# EAGLE design BIRDS-5_FM_+Y Panel_Ver2 (EAGLE 9.6.2)
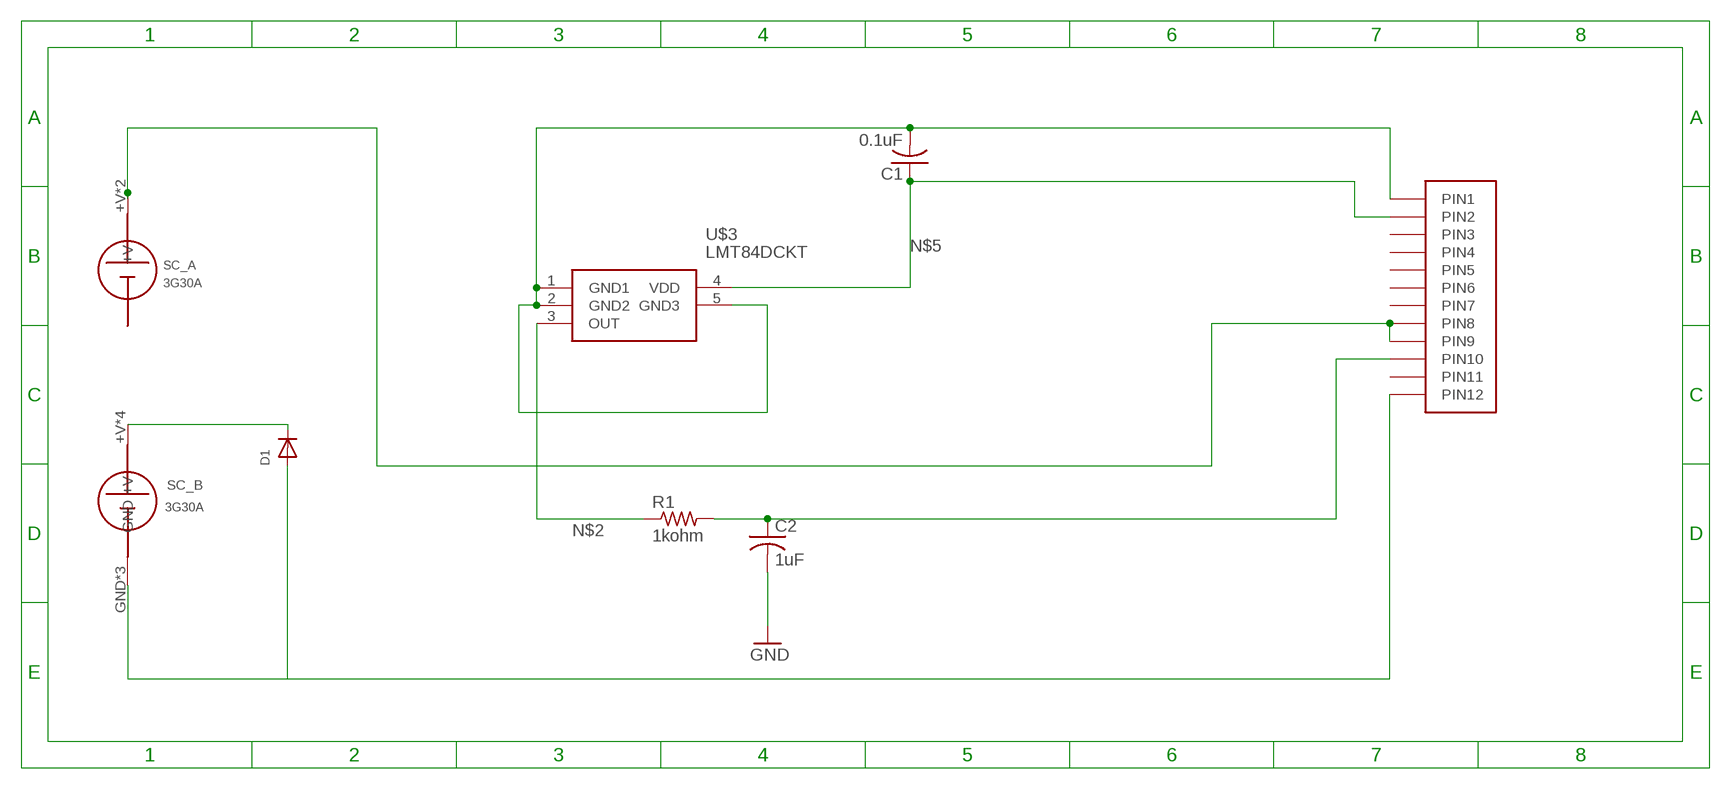
[diagram p0: schematic, sheet 1]

## Parts
C1  0.1uF  C-USC0805  [C0805]
C2  1uF  C-USC0805  [C0805]
D1  DIODE_SOD-123FL  [SOD-123FL]
R1  1kohm  R-US_R0402  [R0402]
SOLARCELL_A  SC_A  [SC_A]
U$1  HEADER12PIN  [HEADER12PIN]
U$2  SC_B-2_SC_B  [SC_B-2_SC_B]
U$3  LMT84DCKT  [SOT65P210X110-5N]

## Nets
+V: SOLARCELL_A.+V SOLARCELL_A.+V1(+V) U$1.P8(PIN8) U$1.P9(PIN9)
+VB: D1.C U$2.+V U$2.+V2(+V) U$2.+V3(+V) U$2.+V4(+V)
GND: C1.2 C2.2 D1.A U$1.P1(PIN1) U$1.P12(PIN12) U$2.GND U$2.GND1(GND) U$2.GND2(GND) U$3.1(GND1) U$3.2(GND2) U$3.5(GND3)
N$2: R1.1 U$3.3(OUT)
N$5: C1.1 U$1.P2(PIN2) U$3.4(VDD)
N$10: C2.1 R1.2 U$1.P10(PIN10)
Unconnected: U$1.P3(PIN3) U$1.P4(PIN4) U$1.P5(PIN5) U$1.P6(PIN6) U$1.P7(PIN7) U$1.P11(PIN11)

## Library data of the parts
C1 C2 = adafruit:C-US: CAPACITOR, American symbol
D1 = adafruit:DIODE: Diode SMADIODE - SMA Surface Mount Package 20V 1A Schottky Diode Digikey: 641-1014-6-ND DO-1N4148 - Through Hole Small Current Diode SOD-123 20V 1 A (.5mV Vf) Schottky Diode - Digikey: MBRX120TPMSCT-ND SOD-323 10V 570mA (.38mV Vf, 3ns) Schottky Diode - Digikey: ZLLS410CT-ND SOD-523 30V 30mA Schottky Diode (RB751S-40TE61) - Digikey: RB751S-40TE61CT-ND SOT23-R/W - SOT23 Package (R = Solder Paste/Reflow Ovens, W = Hand-Soldering) BAT54Film 40V 300mA - Digikey: 497-7162-1-ND
R1 = adafruit:R-US_: RESISTOR, American symbol
SOLARCELL_A = SC_A:SC_A
U$1 = BIRDS:HEADER12PIN
U$2 = B5_EM_-Y_Panel:SC_B-2_SC_B
U$3 = LMT84DCKT:LMT84DCKT: 1.5V-Capable, 10 uA Analog Output Temperature Sensor in SC70 and TO-92 Source: Datasheet <http://uk.rs-online.com/web/p/products/8115860>; DESCRIPTION: 1.5V-Capable, 10 uA Analog Output Temperature Sensor in SC70 and TO-92; HEIGHT: 1.1mm; MANUFACTURER_NAME: Texas Instruments; MANUFACTURER_PART_NUMBER: LMT84DCKT; RS_PART_NUMBER: 8115860

## Board
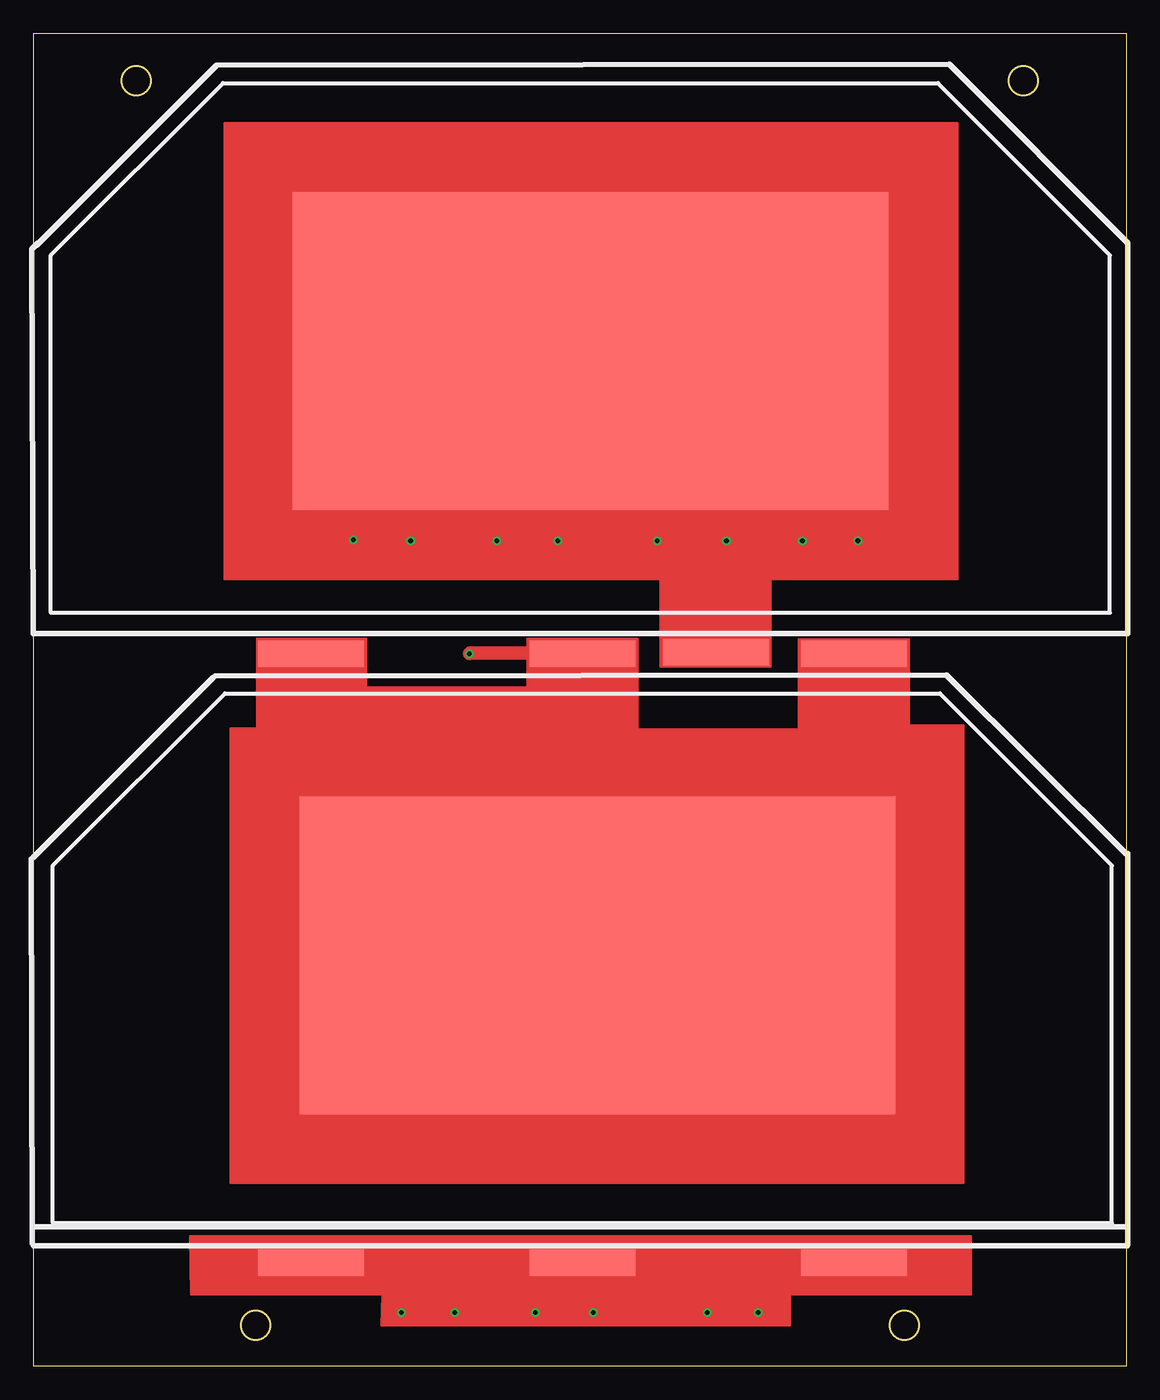
[diagram p1: board, top side]
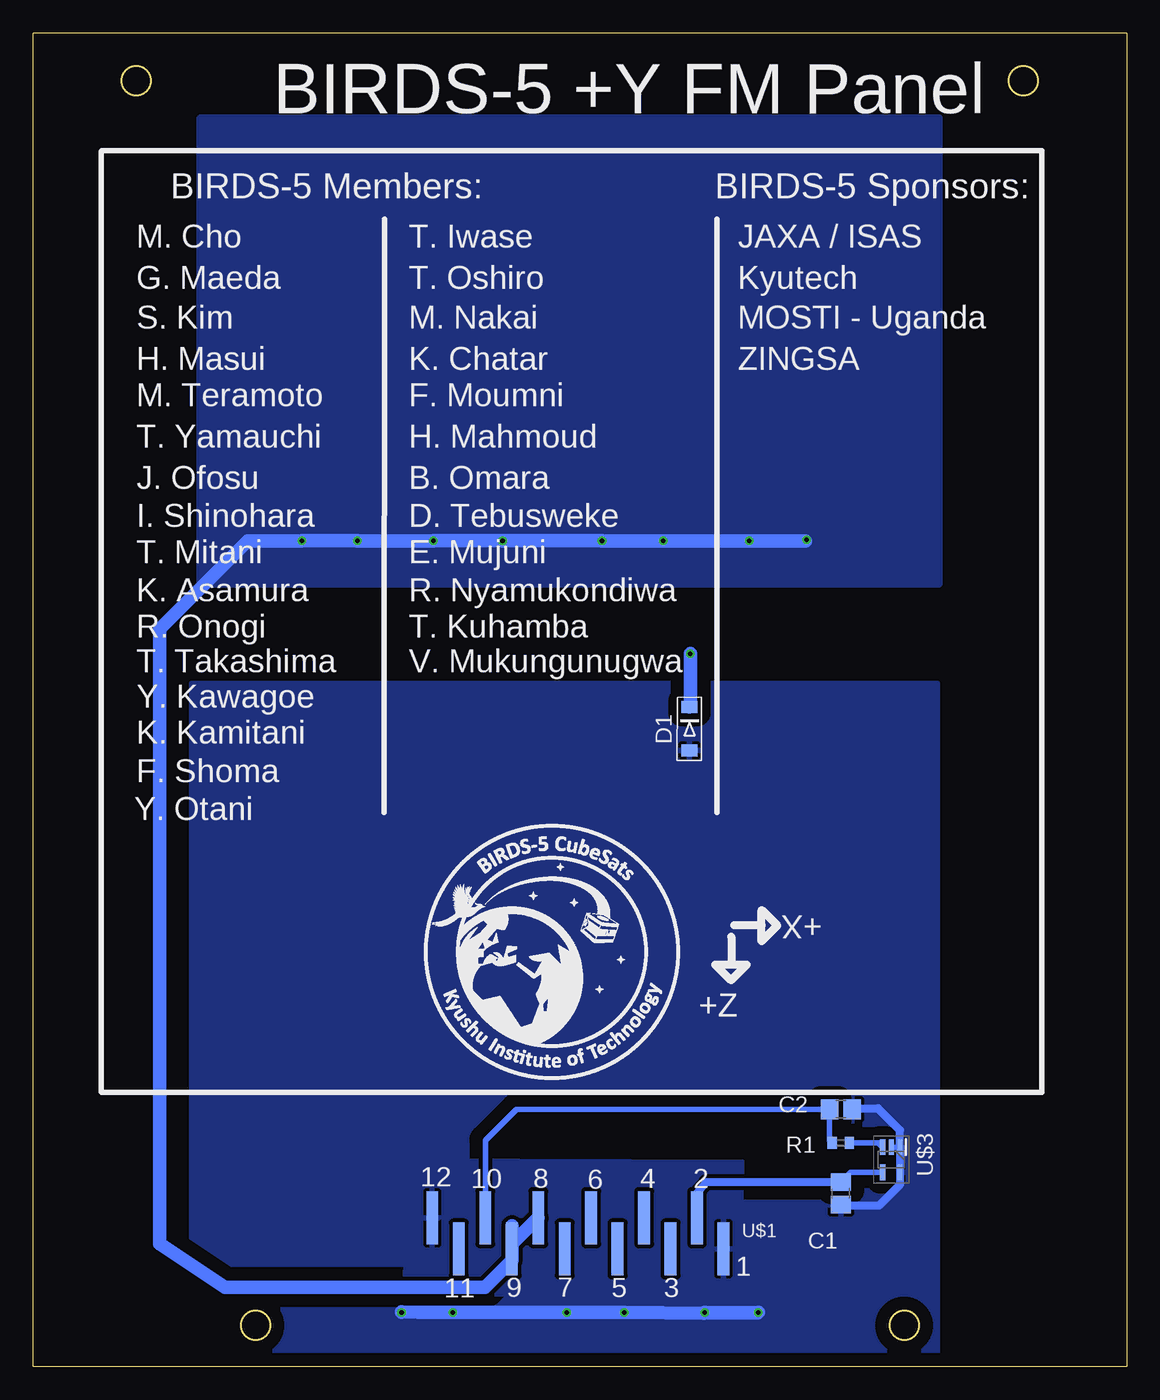
[diagram p2: board, bottom side, seen from below]

Size 82.6 x 100.7 mm. Coordinates in mm from the lower left corner, seen from the top.
Outline: 82.6,0 82.6,100.7 0,100.7 0,0 82.6,0
Outline: circle at 74.8,97.1 radius 1.1
Outline: circle at 65.8,3.1 radius 1.1
Outline: circle at 16.8,3.1 radius 1.1
Outline: circle at 7.8,97.09 radius 1.1
Copper layers (1*16): Top 0.035mm / dielectric 1.53mm / Bottom 0.035mm
Design rules "pban_5mil-l2 *": minimum track width 5mil, minimum drill 0.3mm, track to track 5mil, track to pad 0.229mm, pad to pad 5mil, via to via 5mil, smd to smd 5mil, copper to edge 0.5mm, drill to drill 0.5mm, minimum pad ring 0.15mm, minimum via ring 0.15mm, stop-mask expansion 0.05mm, vias tented up to drill 0.35mm, thermal gap 10mil

### Footprints (pad centres in the part's own frame; a part is rotated, then mirrored left to right if it is on the bottom)
C0805 = smd 1.3 x 1.5: 1 -0.85,0; 2 0.85,0
SOD-123FL = smd 0.91 x 1.22 bottom: A 1.637,0; C -1.637,0
R0402 = smd 0.7 x 0.9: 1 -0.65,0; 2 0.65,0
SC_A = smd 45 x 24: +V 40.75,19.75 | smd 8 x 2: +V1 50.25,-3
HEADER12PIN = smd 4 x 0.89: P1 0,0; P2 2.35,2; P3 0,4; P4 2.35,6; P5 0,8; P6 2.35,10; P7 0,12; P8 2.35,14; P9 0,16; P10 2.35,18; P11 0,20; P12 2.35,22
SC_B-2_SC_B = smd 45 x 24: +V 41.14,20.22 | smd 8 x 2: +V2 19.5,43; +V3 40,43; +V4 60.5,43; GND 60.5,-3; GND1 19.5,-3; GND2 40,-3
SOT65P210X110-5N = smd 1.2 x 0.4: 1 -0.95,0.65; 2 -0.95,0; 3 -0.95,-0.65; 4 0.95,-0.65; 5 0.95,0.65

### Placement (x,y rotation side)
C1  21.59,13.07 270 bottom
C2  21.59,19.42 0 bottom
D1  33.02,48.16 270 top
R1  21.59,16.88 180 bottom
SOLARCELL_A  1.34,56.93 0 top
U$1  30.45,8.88 90 bottom
U$2  1.49,10.83 0 top
U$3  17.78,15.61 270 bottom

### Tracks (layer width: path | path; a pad name or v marks a point on that pad's centre or on a via)
+V  (via drill 0.35)
  Top 0.152: 51.81,53.81 SOLARCELL_A.+V1 | 41.83,76.37 39.63,74.17 v39.63,62.35 39.63,73.65 40.75,74.77 40.75,74.9 42.15,76.3 SOLARCELL_A.+V | 41.83,76.37 42.04,76.37 42.04,76.44 41.9,76.44 41.83,76.37 | 51.81,62.09 52.22,62.09 v52.37,62.35 52.44,62.24
  Top 1.016: 51.81,62.09 51.81,53.81
  Bottom 0.152: 46.44,10.61 46.31,10.4 46.31,10.39 46.29,10.35 46.09,10.15 46.09,9.24 U$1.P9 | 24.25,62.35 v24.18,62.42
  Bottom 1.016: 46.44,10.61 46.44,9.24 | 24.25,62.35 v28.51,62.35 v35.01,62.35 v39.63,62.35 39.64,62.36 47.13,62.36 v47.14,62.35 47.17,62.38 52.33,62.38 v52.37,62.35 v52.38,62.34 v58.1,62.34 v58.11,62.35 v58.12,62.36 v62.29,62.36 v62.3,62.35 66.4,62.35 73.05,55.7 73.05,9.27 68.09,5.97 48.46,5.97 46.44,8 46.44,9.24 | U$1.P8 46.44,9.24
  pour Bottom (isolate 1.016): 14.22,94.28 14.22,59.1 69.95,59.1 69.95,94.27 14.23,94.27
+VB  (via drill 0.35)
  Top 0.152: 39.62,53.83 39.58,53.87
  Top 1.016: 39.58,53.87 33,53.87 v32.96,53.83 | U$2.+V2 20.99,50.73 28.36,43.36 28.36,38.15 35.53,38.15 U$2.+V | U$2.+V4 61.99,43.14 54.06,35.21 46.79,35.21 U$2.+V | 39.62,53.83 U$2.+V3 41.49,39.28 38.99,36.78 38.99,34.69 U$2.+V
  Bottom 1.016: v32.96,53.83 32.96,49.86 D1.C
GND  (via drill 0.35)
  Top 0.152: 37.85,4.16 v37.94,4.08 | 27.84,4.1 v27.82,4.08
  Top 1.016: U$2.GND1 24.98,7.83 27.84,4.97 27.84,4.1 | v42.3,4.08 42.3,7.02 U$2.GND2 U$2.GND 55.76,7.83 54.77,6.84 v54.77,4.08
  Bottom 0.406: U$3.1 U$3.2 | 20.67,19.49 C2.2
  Bottom 0.61: 20.67,19.49 18.79,19.49 17.13,17.83 U$3.1 U$3.5 17.13,13.72 18.69,12.16 21.53,12.16 C1.2
  Bottom 1.016: v27.82,4.08 27.86,4.04 31.82,4.04 v31.86,4.08 31.92,4.02 37.92,4.1 v37.94,4.08 v37.95,4.09 v42.3,4.08 | v42.3,4.08 | v50.91,4.08 53.53,4.08 54.75,4.12 v54.77,4.08 | v42.3,4.08 50.81,4.1
  pour Bottom (isolate 0.305): 29.01,15.45 54.29,15.57 54.56,5.39 48.99,5.46 29.18,5.46
  pour Bottom (isolate 1): 14.29,51.56 70.64,51.56 70.64,0.9 14.29,0.9
N$2
  Bottom 0.406: R1.1 20.92,16.9 18.77,16.9 U$3.3
N$5
  Bottom 0.406: U$3.4 20.85,14.66 C1.1
  Bottom 0.61: C1.1 31.75,13.92 32.45,13.08 U$1.P2
N$10
  Bottom 0.152: R1.2 22.44,17.08
  Bottom 0.406: 22.44,17.08 C2.1 46.1,19.42 48.44,17.08 48.44,11.38 U$1.P10

### Text on the board
bPlace: BIRDS-5 +Y FM Panel | BIRDS-5 Sponsors: | BIRDS-5 Members: | JAXA / ISAS | T. Iwase | M. Cho | Kyutech | T. Oshiro | G. Maeda | MOSTI - Uganda | M. Nakai | S. Kim | ZINGSA | K. Chatar | H. Masui | F. Moumni | M. Teramoto | H. Mahmoud | T. Yamauchi | B. Omara | J. Ofosu | D. Tebusweke | I. Shinohara | E. Mujuni | T. Mitani | R. Nyamukondiwa | K. Asamura | T. Kuhamba | R. Onogi | V. Mukungunugwa | T. Takashima | Y. Kawagoe | K. Kamitani | F. Shoma | Y. Otani | +X | +Z
bNames: 12 | 2 | 4 | 6 | 8 | 10 | U$1 | 1 | 3 | 5 | 7 | 9 | 11